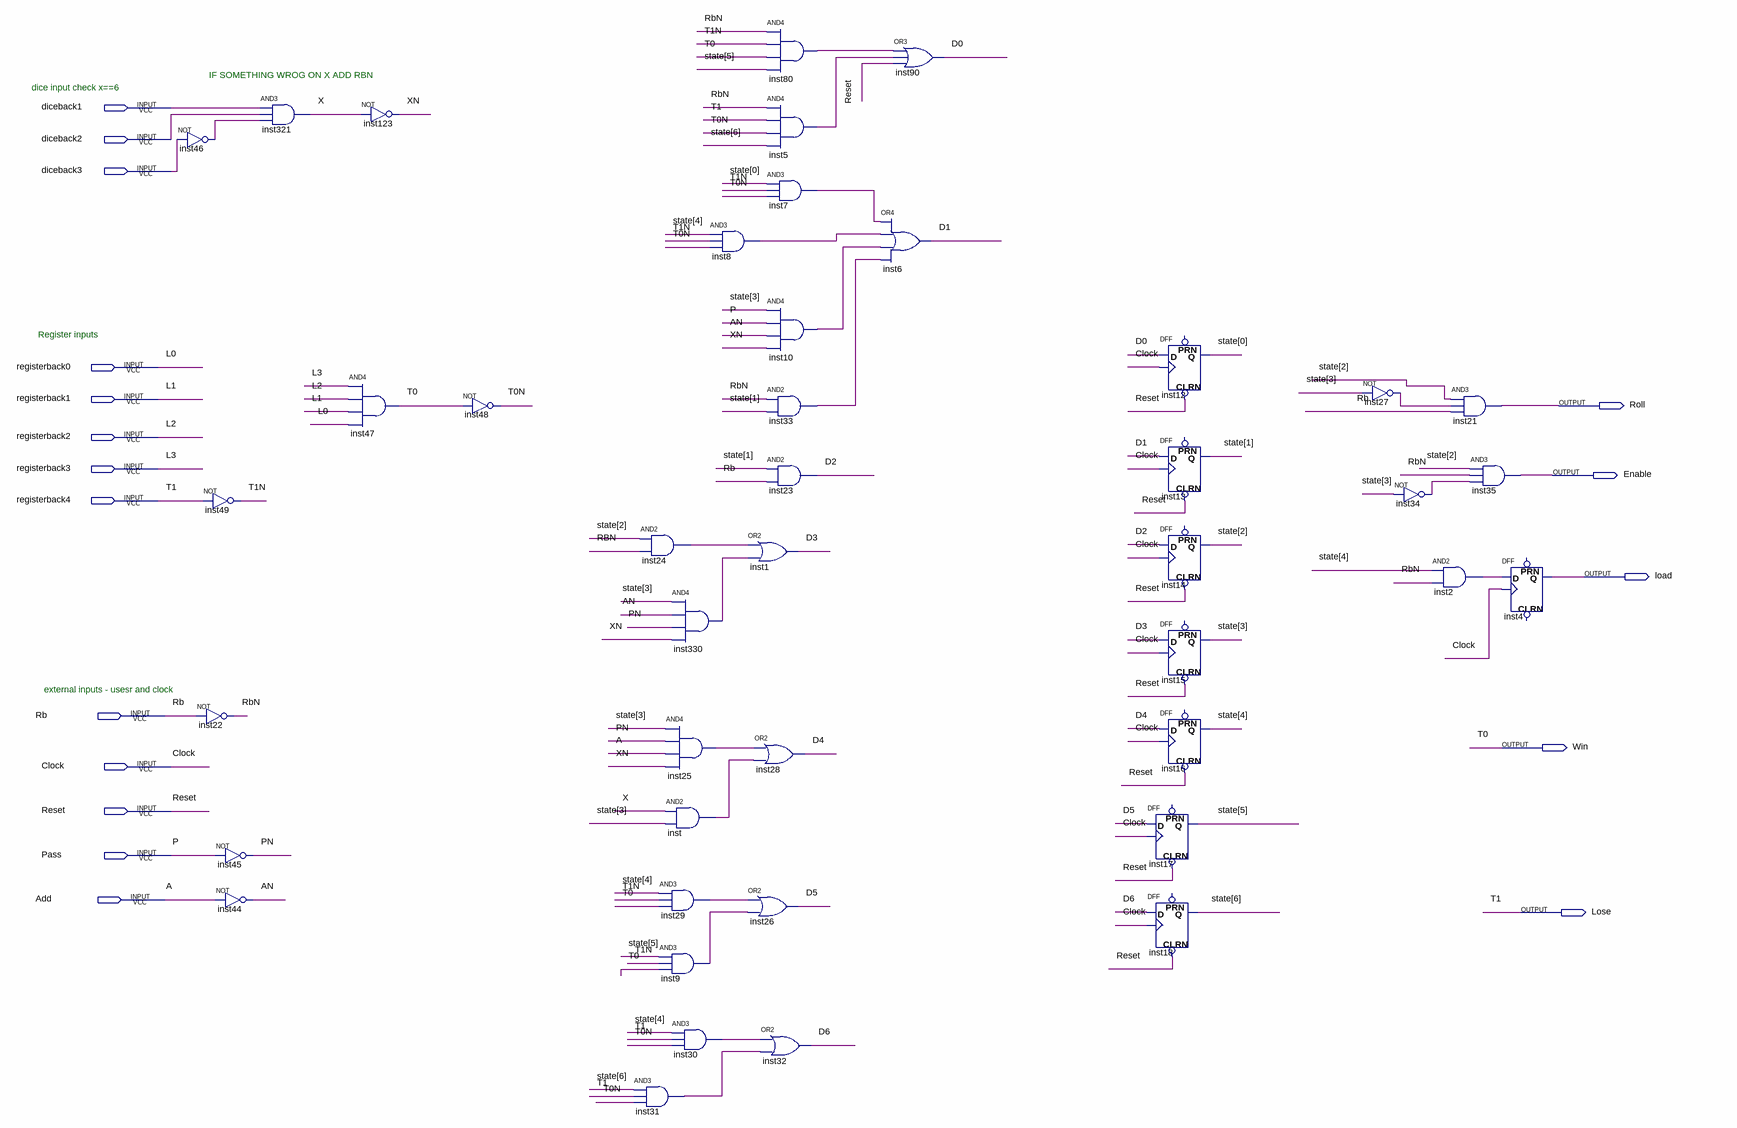
[diagram p0: schematic sheet]
// Quartus schematic control.bdf as structural Verilog: 43 symbols, 18 pins
module control (
  input  diceback1,
  input  diceback2,
  input  diceback3,
  input  registerback0,
  input  registerback1,
  input  registerback2,
  input  registerback3,
  input  registerback4,
  input  Rb,
  input  Clock,
  input  Reset,
  input  Pass,
  input  Add,
  output Roll,
  output Enable,
  output load,
  output Win,
  output Lose
);

  wire AN, D0, D1, D2, D3, D4, D5, D6, inst2_out, inst5_out, inst7_out, inst8_out, inst9_out, inst10_out,
       inst24_out, inst25_out, inst27_out, inst29_out, inst30_out, inst31_out, inst33_out, inst34_out,
       inst46_out, inst80_out, inst330_out, inst_out, PN, RbN, T0N, T1N, X, XN;
  wire [6:0] state;

  not inst46 (inst46_out, diceback3);
  not inst49 (T1N, registerback4);
  not inst22 (RbN, Rb);
  not inst45 (PN, Pass);
  not inst44 (AN, Add);
  and inst321 (X, diceback1, diceback2, inst46_out);
  not inst123 (XN, X);
  and inst47 (Win, registerback3, registerback2, registerback1, registerback0);
  not inst48 (T0N, Win);
  and inst24 (inst24_out, state[2], RbN);
  and inst330 (inst330_out, state[3], AN, PN, XN);
  and inst25 (inst25_out, state[3], PN, Add, XN);
  and inst (inst_out, X, state[3]);
  and inst29 (inst29_out, state[4], T1N, Win);
  and inst9 (inst9_out, state[5], T1N, Win);
  and inst30 (inst30_out, state[4], registerback4, T0N);
  and inst31 (inst31_out, state[6], registerback4, T0N);
  and inst8 (inst8_out, state[4], T1N, T0N);
  and inst80 (inst80_out, RbN, T1N, Win, state[5]);
  and inst5 (inst5_out, RbN, registerback4, T0N, state[6]);
  and inst7 (inst7_out, state[0], T1N, T0N);
  and inst10 (inst10_out, state[3], Pass, AN, XN);
  and inst33 (inst33_out, RbN, state[1]);
  and inst23 (D2, state[1], Rb);
  or inst1 (D3, inst24_out, inst330_out);
  or inst28 (D4, inst25_out, inst_out);
  or inst26 (D5, inst29_out, inst9_out);
  or inst32 (D6, inst30_out, inst31_out);
  or inst6 (D1, inst7_out, inst8_out, inst10_out, inst33_out);
  or inst90 (D0, inst80_out, inst5_out, Reset);
  DFF inst12 (.CLRN(Reset), .CLK(Clock), .D(D0), .Q(state[0]));  // open: PRN
  DFF inst13 (.CLRN(Reset), .CLK(Clock), .D(D1), .Q(state[1]));  // open: PRN
  DFF inst14 (.CLRN(Reset), .CLK(Clock), .D(D2), .Q(state[2]));  // open: PRN
  DFF inst15 (.CLRN(Reset), .CLK(Clock), .D(D3), .Q(state[3]));  // open: PRN
  DFF inst16 (.CLRN(Reset), .CLK(Clock), .D(D4), .Q(state[4]));  // open: PRN
  DFF inst17 (.CLRN(Reset), .CLK(Clock), .D(D5), .Q(state[5]));  // open: PRN
  DFF inst18 (.CLRN(Reset), .CLK(Clock), .D(D6), .Q(state[6]));  // open: PRN
  not inst27 (inst27_out, state[3]);
  not inst34 (inst34_out, state[3]);
  and inst2 (inst2_out, state[4], RbN);
  and inst21 (Roll, state[2], inst27_out, Rb);
  and inst35 (Enable, state[2], RbN, inst34_out);
  DFF inst4 (.CLK(Clock), .D(inst2_out), .Q(load));  // open: CLRN, PRN

  assign Lose = registerback4;

  // Other names for the same wires on the sheet: A = Add; L0 = registerback0; L1 = registerback1; L2 = registerback2;
  //   L3 = registerback3; P = Pass; T0 = Win; T1 = registerback4

  // Notes on the sheet:
  //   IF SOMETHING WROG ON X ADD RBN
  //   dice input check x==6
  //   Register inputs
  //   external inputs - usesr and clock
endmodule
